# EAGLE design submod (EAGLE 4.13)
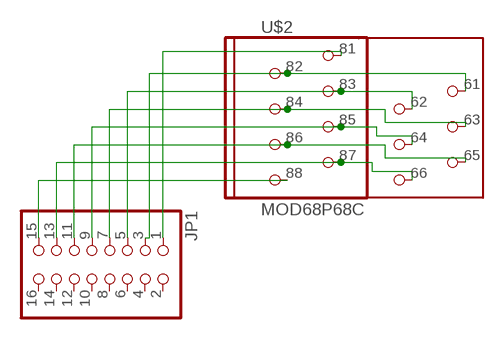
[diagram p0: schematic, sheet 1]

## Parts
JP1  PINHD-2X8  [2X08]
U$2  MOD68P68C  [MOD68P68C]

## Nets
N$1: JP1.3 U$2.61 U$2.82
N$2: JP1.5 U$2.62 U$2.83
N$3: JP1.7 U$2.63 U$2.84
N$4: JP1.9 U$2.64 U$2.85
N$5: JP1.11 U$2.65 U$2.86
N$6: JP1.13 U$2.66 U$2.87
N$7: JP1.1 U$2.81
N$14: JP1.15 U$2.88
Unconnected: JP1.2 JP1.4 JP1.6 JP1.8 JP1.10 JP1.12 JP1.14 JP1.16

## Library data of the parts
JP1 = pinhead:PINHD-2X8: PIN HEADER
U$2 = DEH:MOD68P68C

## Board
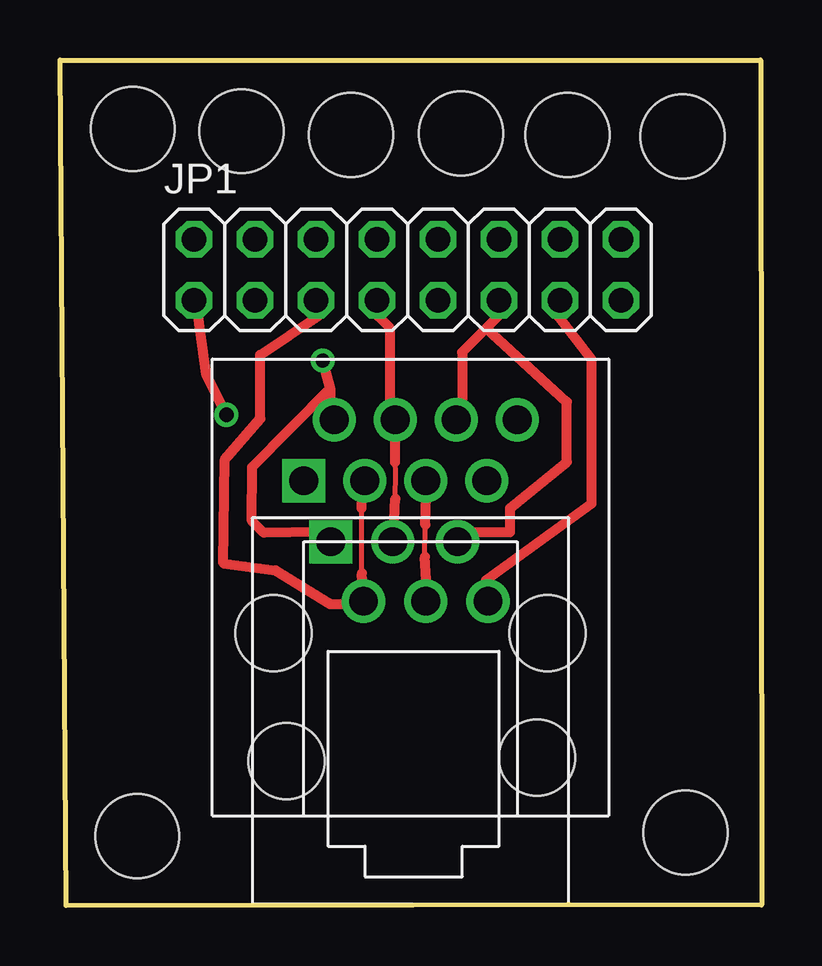
[diagram p1: board, top side]
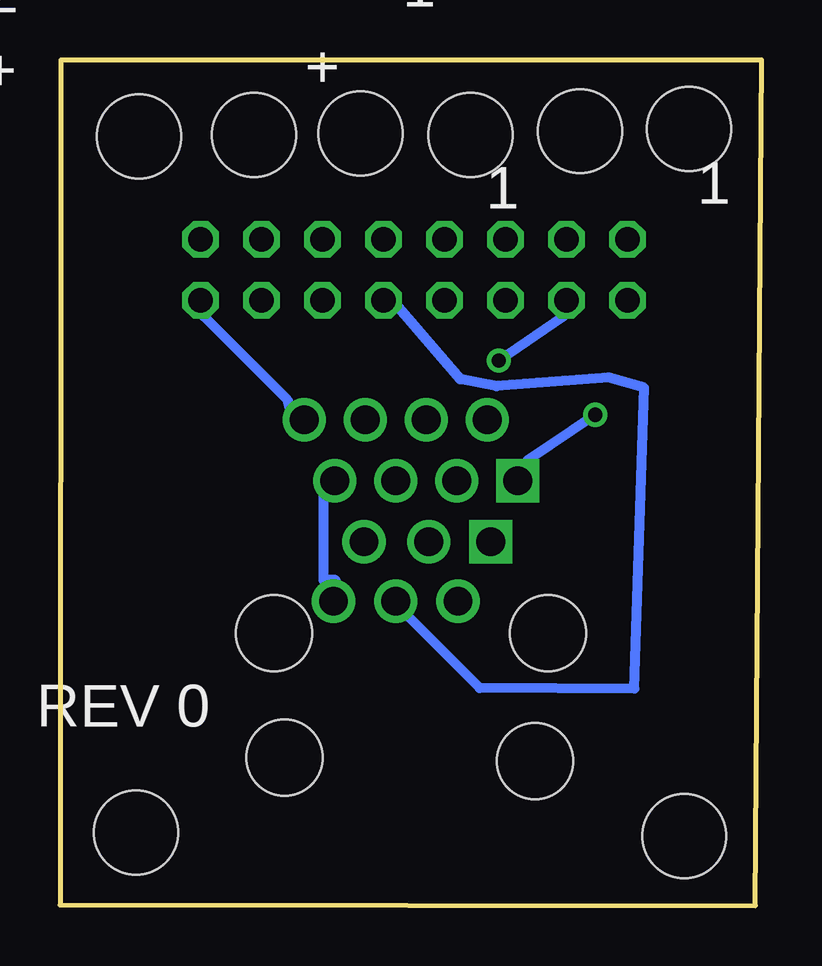
[diagram p2: board, bottom side, seen from below]

Size 29.23 x 35.26 mm. Coordinates in mm from the lower left corner, seen from the top.
Outline: 0.26,0 0,35.26 29.19,35.26 29.23,0.04 0.26,0
Copper layers (1*16): Top 0.035mm / dielectric 1.5mm / Bottom 0.035mm
Design rules "default": minimum track width 8mil, minimum drill 0.6mm, track to track 12mil, track to pad 10mil, pad to pad 10mil, via to via 8mil, smd to smd 0mil, copper to edge 8mil, drill to drill 8mil, minimum pad ring 8mil, minimum via ring 8mil, stop-mask expansion 4mil, vias tented up to drill 0mil, thermal gap 10mil
Holes 3.5 mm at 3.03,32.39 25.94,32.07 3.22,2.91 26.07,3.06 7.57,32.29 12.13,32.14 16.71,32.19 21.15,32.14

### Footprints (pad centres in the part's own frame; a part is rotated, then mirrored left to right if it is on the bottom)
2X08 = drill 1.016 octagon: 1 -8.89,-1.27; 2 -8.89,1.27; 3 -6.35,-1.27; 4 -6.35,1.27; 5 -3.81,-1.27; 6 -3.81,1.27; 7 -1.27,-1.27; 8 -1.27,1.27; 9 1.27,-1.27; 10 1.27,1.27; 11 3.81,-1.27; 12 3.81,1.27; 13 6.35,-1.27; 14 6.35,1.27; 15 8.89,-1.27; 16 8.89,1.27
MOD68P68C = drill 1.2 pad 1.676 square: 61 -3.964,2.54; 81 -5.08,5.08 | drill 1.2 pad 1.676 round: 62 -2.594,0.054; 63 -1.37,2.54; 64 0,0.054; 65 1.324,2.54; 66 2.594,0.054; 82 -3.81,7.62; 83 -2.54,5.08; 84 -1.27,7.62; 85 0,5.08; 86 1.27,7.62; 87 2.54,5.08; 88 3.81,7.62 | hole 3.175: -6.35,-1.27; 5.08,-1.27; -5.807,-6.614; 4.637,-6.46

### Placement (x,y rotation side)
JP1  14.48,26.51 0 top
U$2  15.24,12.64 0 top

### Tracks (layer width: path | path; a pad name or v marks a point on that pad's centre or on a via)
N$1  (via drill 0.6)
  Top 0.406: 11.25,21.58 v10.95,22.73 | 11.25,21.58 11.25,21.08 U$2.82 | 11.25,21.58 8,18.29 7.99,16.05 8.49,15.55 10.75,15.58 U$2.61
  Bottom 0.406: v10.95,22.73 8.25,24.58 JP1.3
N$2
  Top 0.203: 12.61,17.72 U$2.83 | 12.58,13.86 12.57,16.57 | U$2.62 12.73,12.53
  Top 0.406: JP1.5 10.75,24.58 8.34,22.96 8.35,20.31 6.87,18.61 6.81,14.28 8.98,13.98 11.25,12.58 11.75,12.58 U$2.62 | 12.58,13.86 12.61,13.25 12.73,12.53 | 12.57,16.57 12.61,17.72
N$3
  Top 0.203: 13.96,18.49 13.98,18.05 13.97,16.97 | U$2.63 13.89,15.17
  Top 0.406: JP1.7 13.25,24.58 13.75,24.08 13.75,21.08 U$2.84 13.96,18.49 | 13.89,15.17 13.97,16.97
N$4
  Top 0.203: 15.2,14.55 15.22,15.88
  Top 0.406: 15.2,14.55 15.25,13.58 U$2.64 | 15.22,15.88 15.25,17.08 U$2.85
  Bottom 0.406: JP1.9 15.25,25.08 12.56,21.95 11.05,21.66 6.37,22.03 4.89,21.6 5.3,9.05 11.75,9.08 14.75,12.08 U$2.64
N$5
  Top 0.254: U$2.65 17.25,15.58
  Top 0.406: 17.75,24.08 16.75,23.08 16.75,21.08 U$2.86 | 17.75,24.08 18.25,24.58 JP1.11 | 17.25,15.58 18.75,15.58 18.75,16.58 21.12,18.5 21.12,21 17.75,24.08
N$6
  Top 0.406: JP1.13 20.75,24.58 22.15,22.77 22.15,16.77 17.75,13.58 U$2.66
  Bottom 0.254: 18.25,17.08 U$2.87
  Bottom 0.406: 18.25,17.08 18.25,13.58 17.75,13.58 U$2.66
N$7  (via drill 0.6)
  Top 0.406: v6.93,20.47 6.09,22.17 5.75,24.58 JP1.1
  Bottom 0.254: U$2.81 9.75,18.58
  Bottom 0.406: 9.75,18.58 v6.93,20.47
N$14
  Bottom 0.406: JP1.15 23.25,24.58 19.75,21.08 19.66,20.77 U$2.88

### Text on the board
bNames: 1 | 2 | + | + | 1 | 1 | 2 | 2 | REV 0 | ISOFET